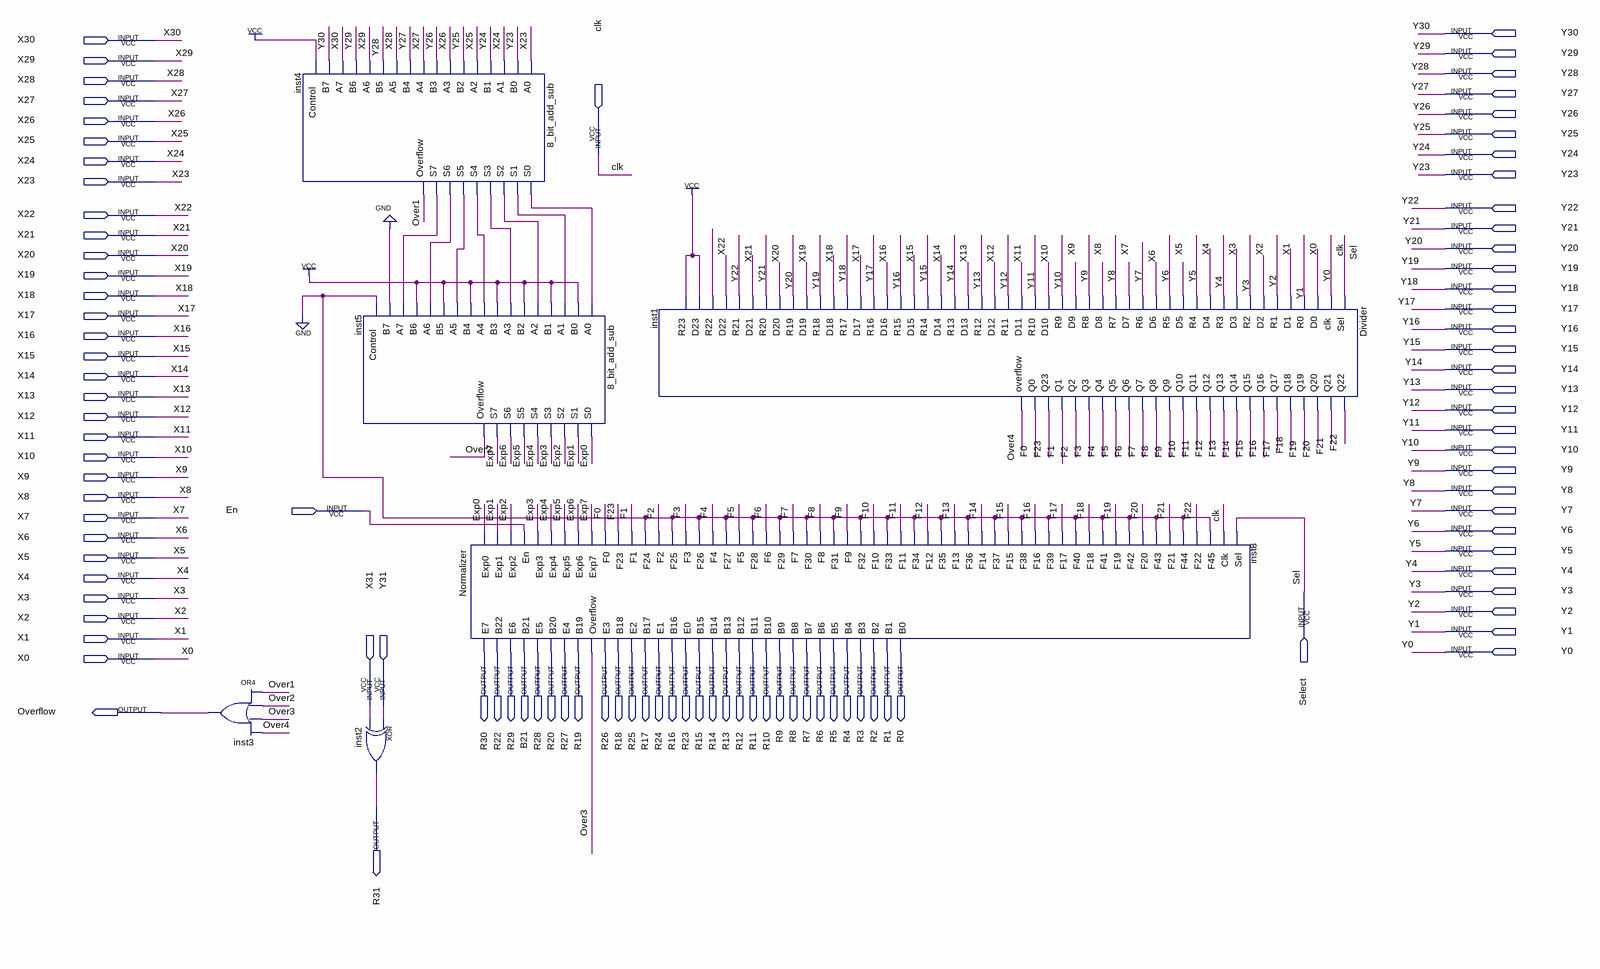
[diagram p0: schematic sheet]
// Quartus schematic Division.bdf as structural Verilog: 6 symbols, 100 pins
module Division (
  input  Y30,
  input  X30,
  input  Y29,
  input  X29,
  input  Y28,
  input  X28,
  input  Y27,
  input  X27,
  input  Y26,
  input  X26,
  input  Y25,
  input  X25,
  input  clk,
  input  Y24,
  input  X24,
  input  Y23,
  input  X23,
  input  Y22,
  input  X22,
  input  Y21,
  input  X21,
  input  Y20,
  input  X20,
  input  Y19,
  input  X19,
  input  Y18,
  input  X18,
  input  Y17,
  input  X17,
  input  Y16,
  input  X16,
  input  Y15,
  input  X15,
  input  Y14,
  input  X14,
  input  Y13,
  input  X13,
  input  Y12,
  input  X12,
  input  Y11,
  input  X11,
  input  Y10,
  input  X10,
  input  Y9,
  input  X9,
  input  Y8,
  input  X8,
  input  En,
  input  Y7,
  input  X7,
  input  Y6,
  input  X6,
  input  Y5,
  input  X5,
  input  Y4,
  input  X4,
  input  Select,
  input  Y3,
  input  X3,
  input  Y2,
  input  X2,
  input  Y1,
  input  X1,
  input  Y0,
  input  X0,
  input  X31,
  input  Y31,
  output R30,
  output R22,
  output R29,
  output B21,
  output R28,
  output R20,
  output R27,
  output R19,
  output R26,
  output R18,
  output R25,
  output R17,
  output R24,
  output R16,
  output R23,
  output R15,
  output R14,
  output R13,
  output R12,
  output R11,
  output R10,
  output R9,
  output R8,
  output R7,
  output R6,
  output R5,
  output R4,
  output R3,
  output R2,
  output R1,
  output R0,
  output Overflow,
  output R31
);

  wire Exp0, Exp1, Exp2, Exp3, Exp4, Exp5, Exp6, Exp7, F0, F1, F2, F3, F4, F5, F6, F7, F8, F9, F10, F11, F12,
       F13, F14, F15, F16, F17, F18, F19, F20, F21, F22, F23, inst4_s0, inst4_s1, inst4_s2, inst4_s3,
       inst4_s4, inst4_s5, inst4_s6, inst4_s7, Over1, Over2, Over3, Over4;

  or inst3 (Overflow, Over1, Over2, Over3, Over4);
  \8_bit_add_sub  inst4 (
    .A0(X23), .B0(Y23), .A1(X24), .B1(Y24), .A2(X25), .B2(Y25), .A3(X26), .B3(Y26), .A4(X27), .B4(Y27),
    .A5(X28), .B5(Y28), .A6(X29), .B6(Y29), .A7(X30), .B7(Y30), .Control(1'b1), .S0(inst4_s0), .S1(inst4_s1),
    .S2(inst4_s2), .S3(inst4_s3), .S4(inst4_s4), .S5(inst4_s5), .S6(inst4_s6), .S7(inst4_s7), .Overflow(Over1));
  \8_bit_add_sub  inst5 (
    .A0(inst4_s0), .B0(1'b1), .A1(inst4_s1), .B1(1'b1), .A2(inst4_s2), .B2(1'b1), .A3(inst4_s3), .B3(1'b1),
    .A4(inst4_s4), .B4(1'b1), .A5(inst4_s5), .B5(1'b1), .A6(inst4_s6), .B6(1'b1), .A7(inst4_s7), .B7(1'b0),
    .Control(1'b0), .S0(Exp0), .S1(Exp1), .S2(Exp2), .S3(Exp3), .S4(Exp4), .S5(Exp5), .S6(Exp6), .S7(Exp7),
    .Overflow(Over2));
  xor inst2 (R31, Y31, X31);
  Normalizer inst8 (
    .Exp0(Exp0), .Exp1(Exp1), .Exp2(Exp2), .En(En), .Exp3(Exp3), .Exp4(Exp4), .Exp5(Exp5), .Exp6(Exp6),
    .Exp7(Exp7), .F0(F0), .F23(F23), .F1(F1), .F24(1'b0), .F2(F2), .F25(1'b0), .F3(F3), .F26(1'b0), .F4(F4),
    .F27(1'b0), .F5(F5), .F28(1'b0), .F6(F6), .F29(1'b0), .F7(F7), .F30(1'b0), .F8(F8), .F31(1'b0), .F9(F9),
    .F32(1'b0), .F10(F10), .F33(1'b0), .F11(F11), .F34(1'b0), .F12(F12), .F35(1'b0), .F13(F13), .F36(1'b0),
    .F14(F14), .F37(1'b0), .F15(F15), .F38(1'b0), .F16(F16), .F39(1'b0), .F17(F17), .F40(1'b0), .F18(F18),
    .F41(1'b0), .F19(F19), .F42(1'b0), .F20(F20), .F43(1'b0), .F21(F21), .F44(1'b0), .F22(F22), .F45(1'b0),
    .Clk(clk), .Sel(Select), .E7(R30), .B22(R22), .E6(R29), .B21(B21), .E5(R28), .B20(R20), .E4(R27),
    .B19(R19), .Overflow(Over3), .E3(R26), .B18(R18), .E2(R25), .B17(R17), .E1(R24), .B16(R16), .E0(R23),
    .B15(R15), .B14(R14), .B13(R13), .B12(R12), .B11(R11), .B10(R10), .B9(R9), .B8(R8), .B7(R7), .B6(R6),
    .B5(R5), .B4(R4), .B3(R3), .B2(R2), .B1(R1), .B0(R0));
  Divider inst1 (
    .Sel(Select), .clk(clk), .D0(Y0), .R0(X0), .D1(Y1), .R1(X1), .D2(Y2), .R2(X2), .D3(Y3), .R3(X3), .D4(Y4),
    .R4(X4), .D5(Y5), .R5(X5), .D6(Y6), .R6(X6), .D7(Y7), .R7(X7), .D8(Y8), .R8(X8), .D9(Y9), .R9(X9),
    .D10(Y10), .R10(X10), .D11(Y11), .R11(X11), .D12(Y12), .R12(X12), .D13(Y13), .R13(X13), .D14(Y14),
    .R14(X14), .D15(Y15), .R15(X15), .D16(Y16), .R16(X16), .D17(Y17), .R17(X17), .D18(Y18), .R18(X18),
    .D19(Y19), .R19(X19), .D20(Y20), .R20(X20), .D21(Y21), .R21(X21), .D22(Y22), .R22(X22), .D23(1'b1),
    .R23(1'b1), .Q22(F22), .Q21(F21), .Q20(F20), .Q19(F19), .Q18(F18), .Q17(F17), .Q16(F16), .Q15(F15),
    .Q14(F14), .Q13(F13), .Q12(F12), .Q11(F11), .Q10(F10), .Q9(F9), .Q8(F8), .Q7(F7), .Q6(F6), .Q5(F5),
    .Q4(F4), .Q3(F3), .Q2(F2), .Q1(F1), .Q23(F23), .Q0(F0), .overflow(Over4));

  // Other names for the same wires on the sheet: Sel = Select
endmodule
